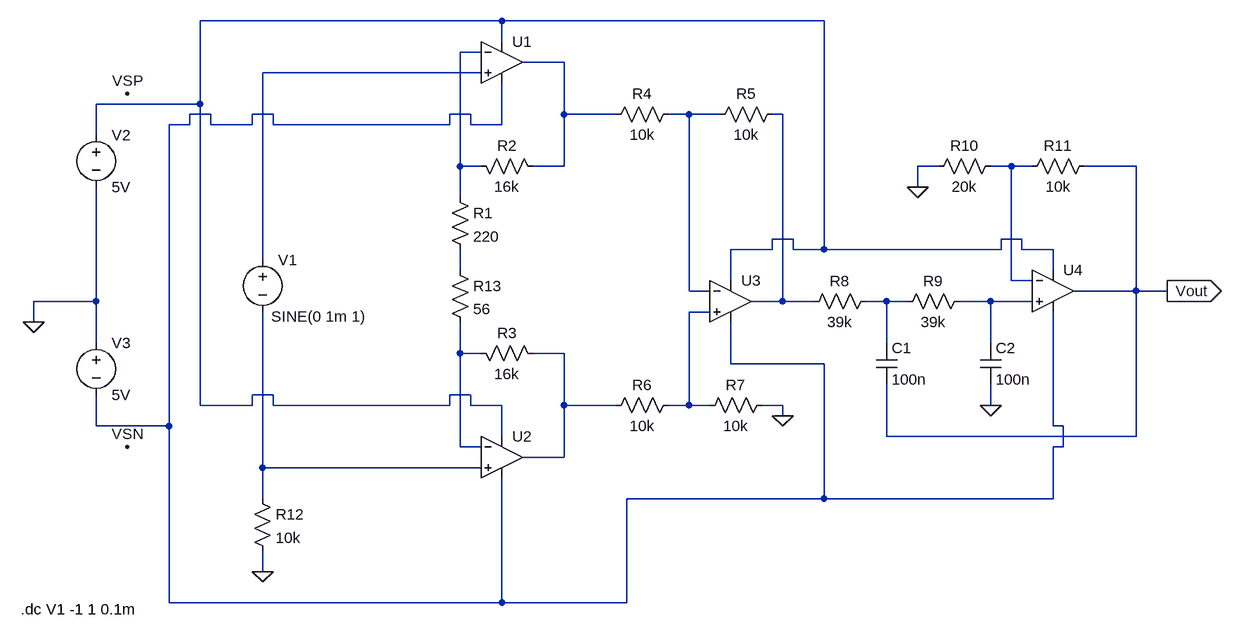
[diagram p0: schematic Proiect-part2.asc]
Proiect-part2.asc, the LTspice schematic file:
Version 4
SHEET 1 1584 680
WIRE 448 -256 -16 -256
WIRE 944 -256 448 -256
WIRE 448 -224 448 -256
WIRE 416 -208 384 -208
WIRE 544 -192 480 -192
WIRE 416 -176 80 -176
WIRE -16 -128 -16 -256
WIRE -16 -128 -176 -128
WIRE 0 -112 -32 -112
WIRE 96 -112 64 -112
WIRE 400 -112 368 -112
WIRE 544 -112 544 -192
WIRE 624 -112 544 -112
WIRE 736 -112 704 -112
WIRE 784 -112 736 -112
WIRE 880 -112 864 -112
WIRE -32 -96 -32 -112
WIRE -32 -96 -64 -96
WIRE 0 -96 0 -112
WIRE 64 -96 64 -112
WIRE 64 -96 0 -96
WIRE 96 -96 96 -112
WIRE 368 -96 368 -112
WIRE 368 -96 96 -96
WIRE 400 -96 400 -112
WIRE 448 -96 448 -160
WIRE 448 -96 400 -96
WIRE -176 -80 -176 -128
WIRE 384 -32 384 -208
WIRE 416 -32 384 -32
WIRE 544 -32 544 -112
WIRE 544 -32 496 -32
WIRE 1120 -32 1088 -32
WIRE 1232 -32 1200 -32
WIRE 1264 -32 1232 -32
WIRE 1424 -32 1344 -32
WIRE 1088 0 1088 -32
WIRE 384 16 384 -32
WIRE 896 80 864 80
WIRE 1248 80 1216 80
WIRE 864 96 864 80
WIRE 864 96 800 96
WIRE 896 96 896 80
WIRE 944 96 944 -256
WIRE 944 96 896 96
WIRE 1216 96 1216 80
WIRE 1216 96 944 96
WIRE 1248 96 1248 80
WIRE 1296 96 1248 96
WIRE 80 112 80 -176
WIRE 384 128 384 96
WIRE 1296 128 1296 96
WIRE 800 144 800 96
WIRE 1232 144 1232 -32
WIRE 1264 144 1232 144
WIRE 736 160 736 -112
WIRE 768 160 736 160
WIRE 1424 160 1424 -32
WIRE 1424 160 1328 160
WIRE 1472 160 1424 160
WIRE -176 176 -176 0
WIRE -176 176 -272 176
WIRE 880 176 880 -112
WIRE 880 176 832 176
WIRE 928 176 880 176
WIRE 1040 176 1008 176
WIRE 1072 176 1040 176
WIRE 1200 176 1152 176
WIRE 1264 176 1200 176
WIRE 768 192 736 192
WIRE -272 208 -272 176
WIRE -176 240 -176 176
WIRE 1040 240 1040 176
WIRE 1200 240 1200 176
WIRE 384 256 384 208
WIRE 416 256 384 256
WIRE 544 256 496 256
WIRE 800 272 800 208
WIRE 944 272 800 272
WIRE 96 320 64 320
WIRE 400 320 368 320
WIRE -16 336 -16 -128
WIRE 64 336 64 320
WIRE 64 336 -16 336
WIRE 96 336 96 320
WIRE 368 336 368 320
WIRE 368 336 96 336
WIRE 400 336 400 320
WIRE 448 336 400 336
WIRE 544 336 544 256
WIRE 624 336 544 336
WIRE 736 336 736 192
WIRE 736 336 704 336
WIRE 768 336 736 336
WIRE 880 336 848 336
WIRE 1200 336 1200 304
WIRE 880 352 880 336
WIRE -176 368 -176 320
WIRE -64 368 -64 -96
WIRE -64 368 -176 368
WIRE 1296 368 1296 192
WIRE 1312 368 1296 368
WIRE 448 384 448 336
WIRE 1040 384 1040 304
WIRE 1424 384 1424 160
WIRE 1424 384 1040 384
WIRE 384 400 384 256
WIRE 416 400 384 400
WIRE 1312 400 1312 368
WIRE 1312 400 1296 400
WIRE 544 416 544 336
WIRE 544 416 480 416
WIRE 80 432 80 192
WIRE 416 432 80 432
WIRE 80 480 80 432
WIRE 944 480 944 272
WIRE 944 480 640 480
WIRE 1296 480 1296 400
WIRE 1296 480 944 480
WIRE 80 592 80 560
WIRE -64 640 -64 368
WIRE 448 640 448 448
WIRE 448 640 -64 640
WIRE 640 640 640 480
WIRE 640 640 448 640
FLAG 80 592 0
FLAG 880 352 0
FLAG 1200 336 0
FLAG 1088 0 0
FLAG -272 208 0
FLAG -128 -144 VSP
FLAG -128 400 VSN
FLAG 1472 160 Vout
IOPIN 1472 160 Out
SYMBOL voltage 80 96 R0
WINDOW 123 24 124 Left 2
WINDOW 39 0 0 Left 0
WINDOW 3 13 103 Left 2
SYMATTR Value SINE(0 1m 1)
SYMATTR InstName V1
SYMBOL res 64 464 R0
SYMATTR InstName R12
SYMATTR Value 10k
SYMBOL res 400 -48 M90
WINDOW 0 0 56 VBottom 2
WINDOW 3 32 56 VTop 2
SYMATTR InstName R2
SYMATTR Value 16k
SYMBOL res 400 240 M90
WINDOW 0 0 56 VBottom 2
WINDOW 3 32 56 VTop 2
SYMATTR InstName R3
SYMATTR Value 16k
SYMBOL res 720 -128 R90
WINDOW 0 0 56 VBottom 2
WINDOW 3 32 56 VTop 2
SYMATTR InstName R4
SYMATTR Value 10k
SYMBOL res 720 320 R90
WINDOW 0 0 56 VBottom 2
WINDOW 3 32 56 VTop 2
SYMATTR InstName R6
SYMATTR Value 10k
SYMBOL res 880 -128 R90
WINDOW 0 0 56 VBottom 2
WINDOW 3 32 56 VTop 2
SYMATTR InstName R5
SYMATTR Value 10k
SYMBOL res 864 320 R90
WINDOW 0 0 56 VBottom 2
WINDOW 3 32 56 VTop 2
SYMATTR InstName R7
SYMATTR Value 10k
SYMBOL res 1024 160 R90
WINDOW 0 0 56 VBottom 2
WINDOW 3 32 56 VTop 2
SYMATTR InstName R8
SYMATTR Value 39k
SYMBOL res 1168 160 R90
WINDOW 0 0 56 VBottom 2
WINDOW 3 32 56 VTop 2
SYMATTR InstName R9
SYMATTR Value 39k
SYMBOL cap 1024 240 R0
SYMATTR InstName C1
SYMATTR Value 100n
SYMBOL cap 1184 240 R0
SYMATTR InstName C2
SYMATTR Value 100n
SYMBOL res 1360 -48 R90
WINDOW 0 0 56 VBottom 2
WINDOW 3 32 56 VTop 2
SYMATTR InstName R11
SYMATTR Value 10k
SYMBOL res 1216 -48 R90
WINDOW 0 0 56 VBottom 2
WINDOW 3 32 56 VTop 2
SYMATTR InstName R10
SYMATTR Value 20k
SYMBOL voltage -176 -96 R0
SYMATTR InstName V2
SYMATTR Value 5V
SYMBOL voltage -176 224 R0
SYMATTR InstName V3
SYMATTR Value 5V
SYMBOL OpAmps\\UniversalOpAmp2 448 -192 R0
SYMATTR InstName U1
SYMBOL OpAmps\\UniversalOpAmp2 448 416 R0
SYMATTR InstName U2
SYMBOL OpAmps\\UniversalOpAmp2 800 176 R0
SYMATTR InstName U3
SYMBOL OpAmps\\UniversalOpAmp2 1296 160 R0
SYMATTR InstName U4
SYMBOL res 368 0 R0
SYMATTR InstName R1
SYMATTR Value 220
SYMBOL res 368 112 R0
SYMATTR InstName R13
SYMATTR Value 56
TEXT -292 650 Left 2 !.dc V1 -1 1 0.1m

The netlist it stands for:
* Proiect-part2.asc
V1 N004 N015 SINE(0 1m 1)
R12 N015 0 10k
R2 N002 N003 16k
R3 N013 N014 16k
R4 N006 N003 10k
R6 N012 N014 10k
R5 N007 N006 10k
R7 0 N012 10k
R8 N010 N007 39k
R9 N011 N010 39k
C1 N010 Vout 100n
C2 N011 0 100n
R11 Vout N008 10k
R10 N008 0 20k
V2 N001 0 5V
V3 0 N005 5V
XU1 N004 N002 N001 N005 N003 level2 Avol=1Meg GBW=10Meg Slew=10Meg Ilimit=25m Rail=0 Vos=0 En=0 Enk=0 In=0 Ink=0 Rin=500Meg  ; pins In+ In- V+ V- OUT
XU2 N015 N013 N001 N005 N014 level2 Avol=1Meg GBW=10Meg Slew=10Meg Ilimit=25m Rail=0 Vos=0 En=0 Enk=0 In=0 Ink=0 Rin=500Meg  ; pins In+ In- V+ V- OUT
XU3 N012 N006 N001 N005 N007 level2 Avol=1Meg GBW=10Meg Slew=10Meg Ilimit=25m Rail=0 Vos=0 En=0 Enk=0 In=0 Ink=0 Rin=500Meg  ; pins In+ In- V+ V- OUT
XU4 N011 N008 N001 N005 Vout level2 Avol=1Meg GBW=10Meg Slew=10Meg Ilimit=25m Rail=0 Vos=0 En=0 Enk=0 In=0 Ink=0 Rin=500Meg  ; pins In+ In- V+ V- OUT
R1 N002 N009 220
R13 N009 N013 56
.dc V1 -1 1 0.1m
.lib UniversalOpAmp2.lib
.backanno
.end